# Altium schematic sheet CH564L-R0-1v0.SchDoc
size A3
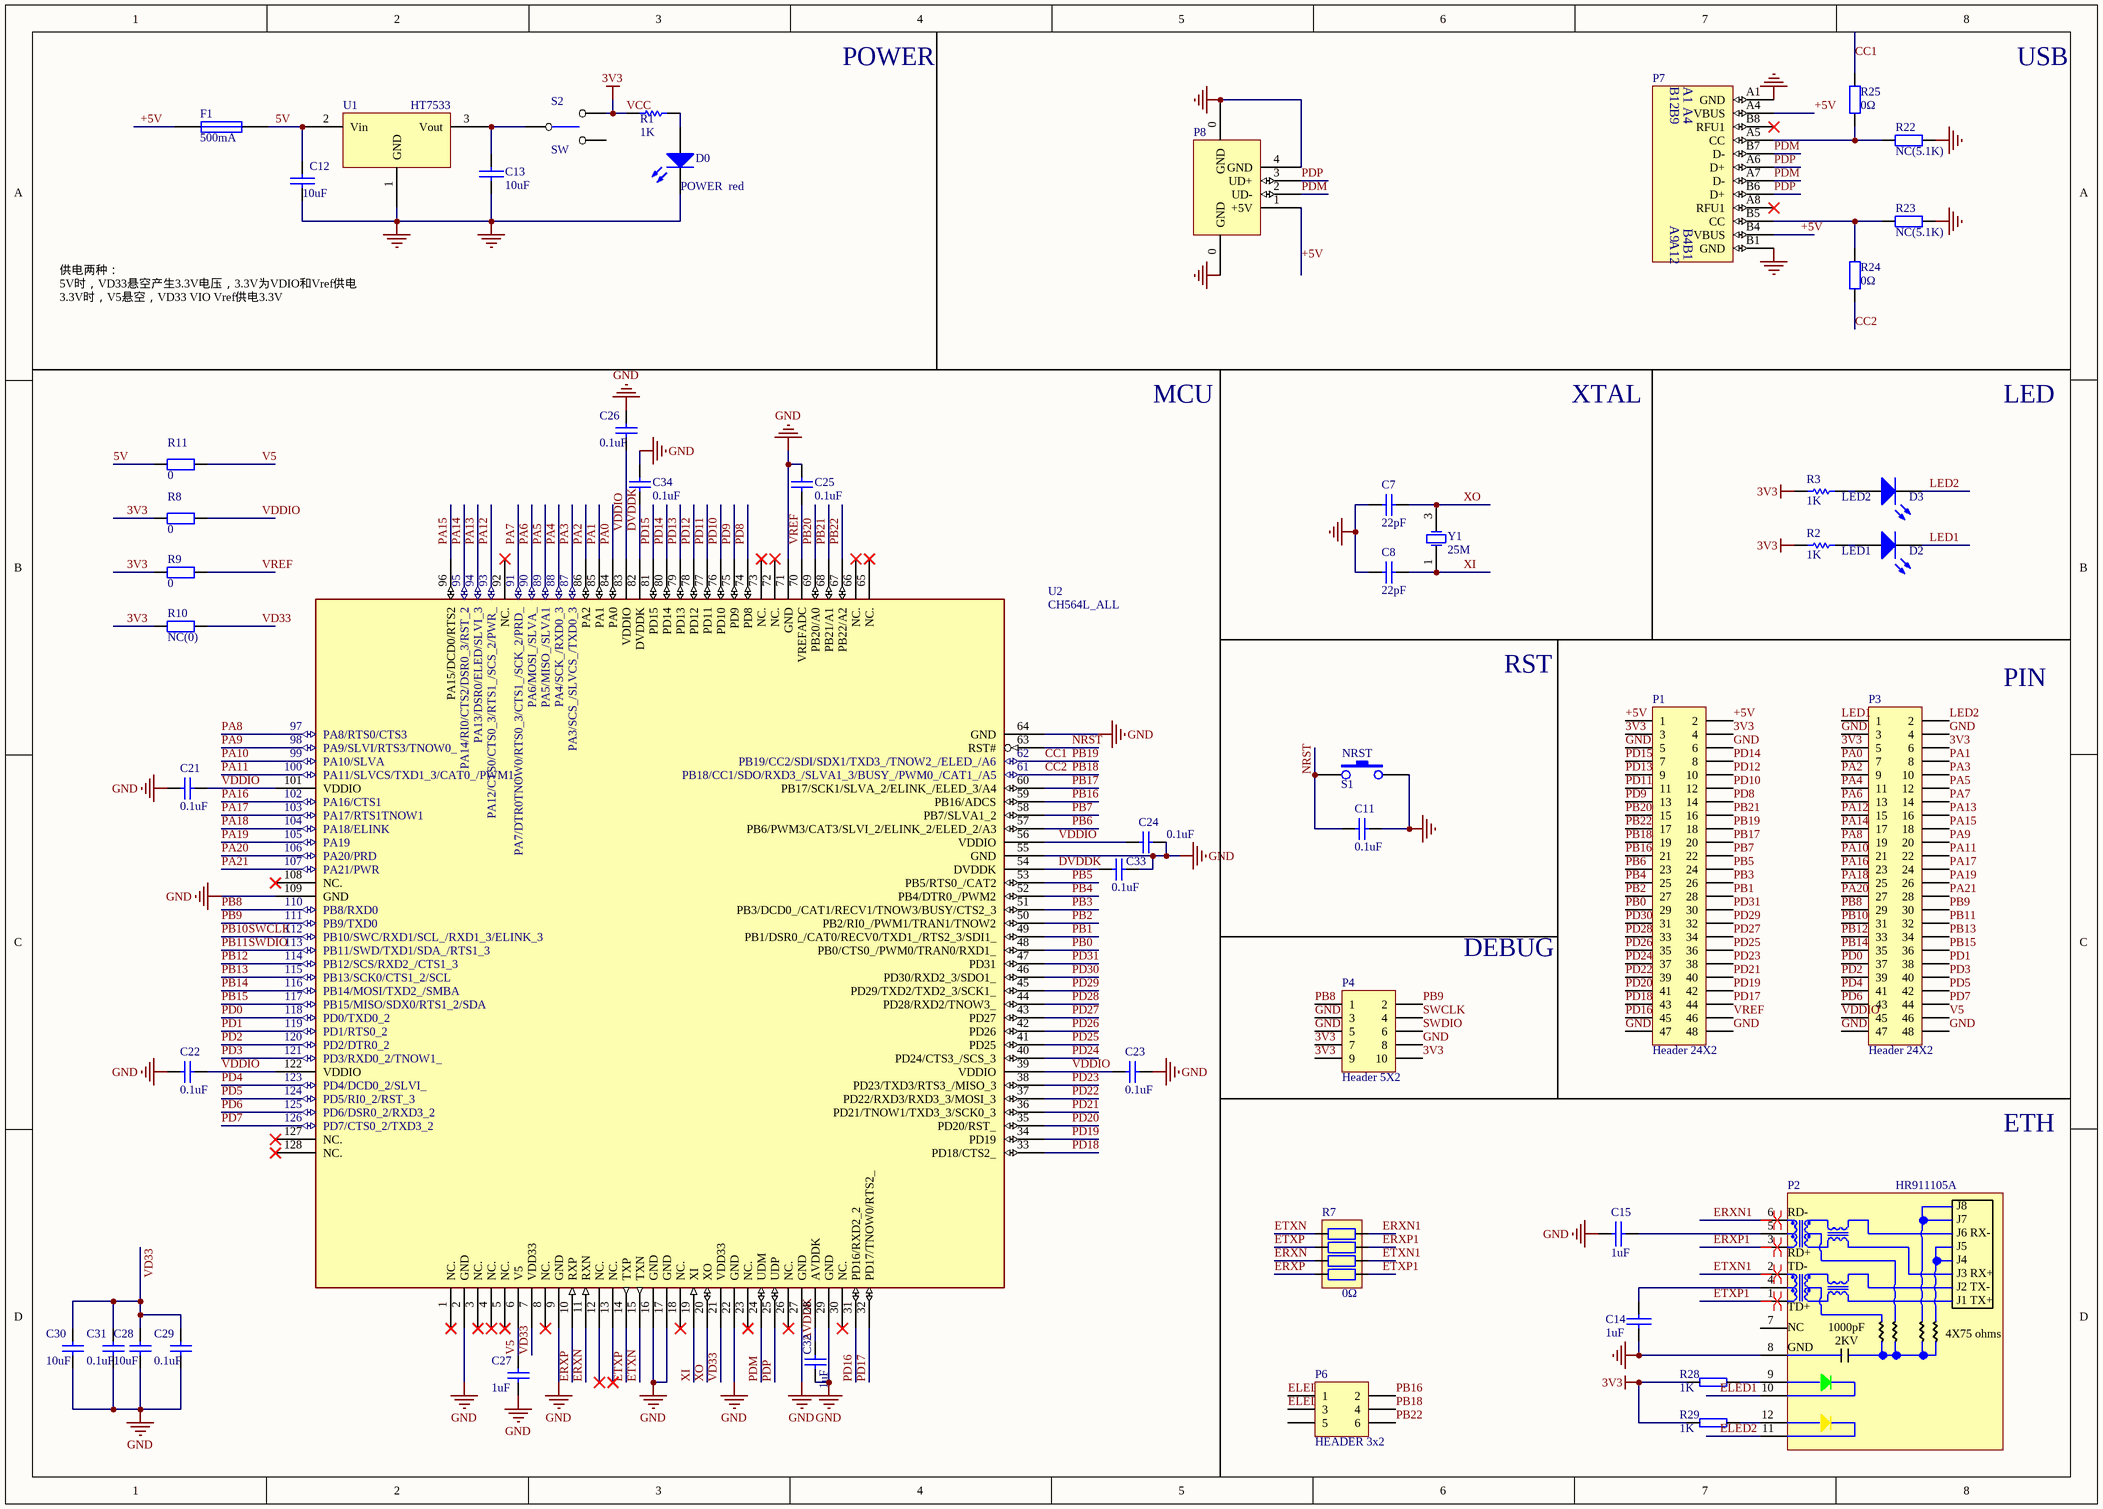
[diagram p0: CH564L-R0-1v0.SchDoc]

## Parts
C7  22pF  [0402_C]
C8  22pF  [0402_C]
C11  0.1uF  [0402_C]
C12  10uF  [0603_C]
C13  10uF  [0603_C]
C14  1uF  [0402_C]
C15  1uF  [0402_C]
C21  0.1uF  [0402_C]
C22  0.1uF  [0402_C]
C23  0.1uF  [0402_C]
C24  0.1uF  [0402_C]
C25  0.1uF  [0402_C]
C26  0.1uF  [0402_C]
C27  1uF  [0402_C]
C28  10uF  [0603_C]
C29  0.1uF  [0402_C]
C30  10uF  [0603_C]
C31  0.1uF  [0402_C]
C32  1uF  [0402_C]
C33  0.1uF  [0402_C]
C34  0.1uF  [0402_C]
D0  POWER  red  [0603+]
D2  LED1  [0603+]
D3  LED2  [0603+]
F1  500mA  [0603]
P1  Header 24X2  [IDC48-2.54mm]
P2  HR911105A  [HR911105A]
P3  Header 24X2  [IDC48-2.54mm]
P4  Header 5X2  [IDC10-2.54mm]
P6  HEADER 3x2  [IDC6-2.54mm]
P7  TYPE-C  [TYPE-C-Receptacle-2.0]  (value not drawn)
P8  USB_A  [USBAF]  (value not drawn)
R1  1K  [0402]
R2  1K  [0402]
R3  1K  [0402]
R7  0Ω  [RCA-8P4R-0603]
R8  0  [0402]
R9  0  [0402]
R10  NC(0)  [0402]
R11  0  [0402]
R22  NC(5.1K)  [0402]
R23  NC(5.1K)  [0402]
R24  0Ω  [0402]
R25  0Ω  [0402]
R28  1K  [0402]
R29  1K  [0402]
S1  NRST  [SMD_6.1x3.65x2.5mm-KEY]
S2  SW  [SW1]
U1  HT7533  [SOT-89]
U2  CH564L_ALL  [LQFP128]
Y1  25M  [XT3225]

## Nets
3V3: P1.3 P1.4 P3.5 P3.6 P4.7 P4.9 P4.10 R1.2 R2.1 R3.1 R8.2 R9.2 R10.2 R28.1 R29.1 S2.3  [also labelled VCC]
GND: C7.1 C8.1 C11.1 C12.2 C13.2 C14.1 C15.2 C21.1 C22.1 C23.2 C24.2 C25.2 C26.2 C27.1 C28.1 C29.1 C30.1 C31.1 C32.1 C33.2 C34.2 D0.2(K) P1.5 P1.6 P1.47 P1.48 P2.8 P3.3 P3.4 P3.47 P3.48 P4.3 P4.5 P4.8 P7.A1(GND) P7.B1(GND) P8.0(GND) P8.4(GND) R22.2 R23.2 S1.2 U1.1(GND) U2.2(GND) U2.9(GND) U2.16(GND) U2.17(GND) U2.22(GND) U2.27(GND) U2.29(GND) U2.55(GND) U2.64(GND) U2.71(GND) U2.109(GND)
5V: C12.1 F1.2 R11.2 U1.2(Vin)
+5V: F1.1 P1.1 P1.2 P7.A4(VBUS) P7.B4(VBUS) P8.1(+5V)
AVDDK: C32.2 U2.28(AVDDK)
CC1: P1.18 R25.2 U2.62(PB19/CC2/SDI/SDX1/TXD3_/TNOW2_/ELED_/A6)  [also labelled PB19]
CC2: P1.19 P6.4 R24.1 U2.61(PB18/CC1/SDO/RXD3_/SLVA1_3/BUSY_/PWM0_/CAT1_/A5)  [also labelled PB18]
DVDDK: C33.1 C34.1 U2.54(DVDDK) U2.82(DVDDK)
ELED1: P2.10 P6.3
ELED2: P2.11 P6.1
ERXN: R7.3 U2.11(RXN)
ERXN1: P2.6 R7.8
ERXP: R7.4 U2.10(RXP)
ERXP1: P2.3 R7.7
ETXN: R7.1 U2.15(TXN)
ETXN1: P2.2 R7.6
ETXP: R7.2 U2.14(TXP)
ETXP1: P2.1 R7.5
LED1: D2.2(K) P3.1
LED2: D3.2(K) P3.2
NRST: C11.2 S1.1 U2.63(RST#)
PA0: P3.7 U2.84(PA0)
PA1: P3.8 U2.85(PA1)
PA2: P3.9 U2.86(PA2)
PA3: P3.10 U2.87(PA3/SCS_/SLVCS_/TXD0_3)
PA4: P3.11 U2.88(PA4/SCK_/RXD0_3)
PA5: P3.12 U2.89(PA5/MISO_/SLVA1)
PA6: P3.13 U2.90(PA6/MOSI_/SLVA_)
PA7: P3.14 U2.91(PA7/DTR0TNOW0/RTS0_3/CTS1_/SCK_2/PRD_)
PA8: P3.19 U2.97(PA8/RTS0/CTS3)
PA9: P3.20 U2.98(PA9/SLVI/RTS3/TNOW0_)
PA10: P3.21 U2.99(PA10/SLVA)
PA11: P3.22 U2.100(PA11/SLVCS/TXD1_3/CAT0_/PWM1_)
PA12: P3.15 U2.93(PA12/CTS0/CTS0_3/RTS1_/SCS_2/PWR_)
PA13: P3.16 U2.94(PA13/DSR0/ELED/SLVI_3)
PA14: P3.17 U2.95(PA14/RI0/CTS2/DSR0_3/RST_2)
PA15: P3.18 U2.96(PA15/DCD0/RTS2)
PA16: P3.23 U2.102(PA16/CTS1)
PA17: P3.24 U2.103(PA17/RTS1TNOW1)
PA18: P3.25 U2.104(PA18/ELINK)
PA19: P3.26 U2.105(PA19)
PA20: P3.27 U2.106(PA20/PRD)
PA21: P3.28 U2.107(PA21/PWR)
PB0: P1.29 U2.48(PB0/CTS0_/PWM0/TRAN0/RXD1_)
PB1: P1.28 U2.49(PB1/DSR0_/CAT0/RECV0/TXD1_/RTS2_3/SDI1_)
PB2: P1.27 U2.50(PB2/RI0_/PWM1/TRAN1/TNOW2)
PB3: P1.26 U2.51(PB3/DCD0_/CAT1/RECV1/TNOW3/BUSY/CTS2_3)
PB4: P1.25 U2.52(PB4/DTR0_/PWM2)
PB5: P1.24 U2.53(PB5/RTS0_/CAT2)
PB6: P1.23 U2.57(PB6/PWM3/CAT3/SLVI_2/ELINK_2/ELED_2/A3)
PB7: P1.22 U2.58(PB7/SLVA1_2)
PB8: P3.29 P4.1 U2.110(PB8/RXD0)
PB9: P3.30 P4.2 U2.111(PB9/TXD0)
PB10: P3.31 P4.4 U2.112(PB10/SWC/RXD1/SCL_/RXD1_3/ELINK_3)  [also labelled SWCLK]
PB11: P3.32 P4.6 U2.113(PB11/SWD/TXD1/SDA_/RTS1_3)  [also labelled SWDIO]
PB12: P3.33 U2.114(PB12/SCS/RXD2_/CTS1_3)
PB13: P3.34 U2.115(PB13/SCK0/CTS1_2/SCL)
PB14: P3.35 U2.116(PB14/MOSI/TXD2_/SMBA)
PB15: P3.36 U2.117(PB15/MISO/SDX0/RTS1_2/SDA)
PB16: P1.21 P6.2 U2.59(PB16/ADCS)
PB17: P1.20 U2.60(PB17/SCK1/SLVA_2/ELINK_/ELED_3/A4)
PB20: P1.15 U2.69(PB20/A0)
PB21: P1.16 U2.68(PB21/A1)
PB22: P1.17 P6.6 U2.67(PB22/A2)
PD0: P3.37 U2.118(PD0/TXD0_2)
PD1: P3.38 U2.119(PD1/RTS0_2)
PD2: P3.39 U2.120(PD2/DTR0_2)
PD3: P3.40 U2.121(PD3/RXD0_2/TNOW1_)
PD4: P3.41 U2.123(PD4/DCD0_2/SLVI_)
PD5: P3.42 U2.124(PD5/RI0_2/RST_3)
PD6: P3.43 U2.125(PD6/DSR0_2/RXD3_2)
PD7: P3.44 U2.126(PD7/CTS0_2/TXD3_2)
PD8: P1.14 U2.74(PD8)
PD9: P1.13 U2.75(PD9)
PD10: P1.12 U2.76(PD10)
PD11: P1.11 U2.77(PD11)
PD12: P1.10 U2.78(PD12)
PD13: P1.9 U2.79(PD13)
PD14: P1.8 U2.80(PD14)
PD15: P1.7 U2.81(PD15)
PD16: P1.45 U2.31(PD16/RXD2_2)
PD17: P1.44 U2.32(PD17/TNOW0/RTS2_)
PD18: P1.43 U2.33(PD18/CTS2_)
PD19: P1.42 U2.34(PD19)
PD20: P1.41 U2.35(PD20/RST_)
PD21: P1.40 U2.36(PD21/TNOW1/TXD3_3/SCK0_3)
PD22: P1.39 U2.37(PD22/RXD3/RXD3_3/MOSI_3)
PD23: P1.38 U2.38(PD23/TXD3/RTS3_/MISO_3)
PD24: P1.37 U2.40(PD24/CTS3_/SCS_3)
PD25: P1.36 U2.41(PD25)
PD26: P1.35 U2.42(PD26)
PD27: P1.34 U2.43(PD27)
PD28: P1.33 U2.44(PD28/RXD2/TNOW3_)
PD29: P1.32 U2.45(PD29/TXD2/TXD2_3/SCK1_)
PD30: P1.31 U2.46(PD30/RXD2_3/SDO1_)
PD31: P1.30 U2.47(PD31)
PDM: P7.A7(D-) P7.B7(D-) P8.2(UD-) U2.24(UDM)
PDP: P7.A6(D+) P7.B6(D+) P8.3(UD+) U2.25(UDP)
V5: C27.2 P3.46 R11.1 U2.6(V5)
VD33: C28.2 C29.2 C30.2 C31.2 R10.1 U2.7(VDD33) U2.21(VDD33)
VDDIO: C21.2 C22.2 C23.1 C24.1 C26.1 P3.45 R8.1 U2.39(VDDIO) U2.56(VDDIO) U2.83(VDDIO) U2.101(VDDIO) U2.122(VDDIO)
VREF: C25.1 P1.46 R9.1 U2.70(VREFADC)
XI: C8.2 U2.19(XI) Y1.1(OSC1)
XO: C7.2 U2.20(XO) Y1.3(OSC2)
NetC13_1: C13.1 S2.1 U1.3(Vout)
NetC14_2: C14.2 P2.4
NetC15_1: C15.1 P2.5
NetD0_1: D0.1(A) R1.1
NetD2_1: D2.1(A) R2.2
NetD3_1: D3.1(A) R3.2
NetP2_9: P2.9 R28.2
NetP2_12: P2.12 R29.2
NetP7_A5: P7.A5(CC) R22.1 R25.1
NetP7_B5: P7.B5(CC) R23.1 R24.2

Not connected (* = marked no-connect by the designer): P2 7; P6 5; P7 A8(RFU1)* B8(RFU1)*; S2 2; U2 1(NC.)* 3(NC.)* 4(NC.)* 5(NC.)* 8(NC.)* 12(NC.)* 13(NC.)* 18(NC.)* 23(NC.)* 26(NC.)* 30(NC.)* 65(NC.)* 66(NC.)* 72(NC.)* 73(NC.)* 92(NC.)* 108(NC.)* 127(NC.)* 128(NC.)*

## Layout directives
differential pair: ERXN1, ERXP1, ETXN1, ETXP1

## Notes on the sheet
- POWER
- USB
- 供电两种：
  5V时，VD33悬空产生3.3V电压，3.3V为VDIO和Vref供电
  3.3V时，V5悬空，VD33 VIO Vref供电3.3V
- MCU
- XTAL
- LED
- RST
- PIN
- DEBUG
- ETH
- (in symbol HR911105A) J8; RD-; J7; J6; RX-; J5; RD+; J4; TD-; J3; RX+; J2; TX-; J1; TX+; TD+; NC; 1000pF; 4X75 ohms; 2KV; GND
- (in symbol TYPE-C1) B12; B9; A9; A12

## Library data of the parts
C7 C8 C11 = Cap: Capacitor; Published: 8-Jun-2000; LatestRevisionDate: 17-Jul-2002; LatestRevisionNote: Re-released for DXP Platform.; PackageReference: RAD-0.3; Publisher: Altium Limited
  C11: Value: 0.1uF
C12-C15 = CAP: Capacitor
C21-C34 = C0603: Capacitor; Published: 8-Jun-2000; LatestRevisionDate: 17-Jul-2002; LatestRevisionNote: Re-released for DXP Platform.; PackageReference: RAD-0.3; Publisher: Altium Limited; PackageDescription: Radial Cap, Thru-Hole; 2 Leads; 0.3 in Pin Spacing
D0 D2 D3 = LED0: Typical INFRARED GaAs LED; Published: 8-Jun-2000; LatestRevisionDate: 08-Jul-2005; LatestRevisionNote: Mech Layer 1 removed.; PackageReference: LED-0; Publisher: Altium Limited
F1 = FUSE1: Fuse
P1 P3 = Header 24X2: Header, 24-Pin, Dual row; LatestRevisionDate: 17-Jul-2002; LatestRevisionNote: Re-released for DXP Platform.; Publisher: Altium Limited
P4 = Header 5X2: Header, 5-Pin, Dual row; LatestRevisionDate: 17-Jul-2002; LatestRevisionNote: Re-released for DXP Platform.; Publisher: Altium Limited
P6 = HEADER 3x2: Header, 3-Pin, Dual row
P7 = TYPE-C1
P8 = USB: USB Port
R1-R3 = Res Semi: Semiconductor Resistor
  R2 R3: Published: 8-Jun-2000; LatestRevisionDate: 17-Jul-2002; LatestRevisionNote: Re-released for DXP Platform.; PackageReference: AXIAL-0.5; Publisher: Altium Limited; Value: 1K
R7 = R-8P4R: 贴片网络排阻; 版权归属: 源创客; BOM名称: 贴片网络排阻; 学习资源: www.ooocke.com
R8-R11 = Res2: Resistor; Value: 10K; Published: 8-Jun-2000; LatestRevisionDate: 17-Jul-2002; LatestRevisionNote: Re-released for DXP Platform.; PackageReference: AXIAL-0.4; Publisher: Altium Limited
R22-R25 = Res2: Resistor
R28 R29 = RES
S1 = KEY
U1 = 1117-3.3V
U2 = CH564L_ALL: RISC-V MCU with USB OTG 2.0 & 100Mbps Ethernet
Y1 = XTAL: Crystal Oscillator; Published: 8-Jun-2000; LatestRevisionDate: 17-Jul-2002; LatestRevisionNote: Re-released for DXP Platform.; PackageReference: R38; Publisher: Altium Limited